# Altium schematic sheet Block Diagram.SchDoc
size A4
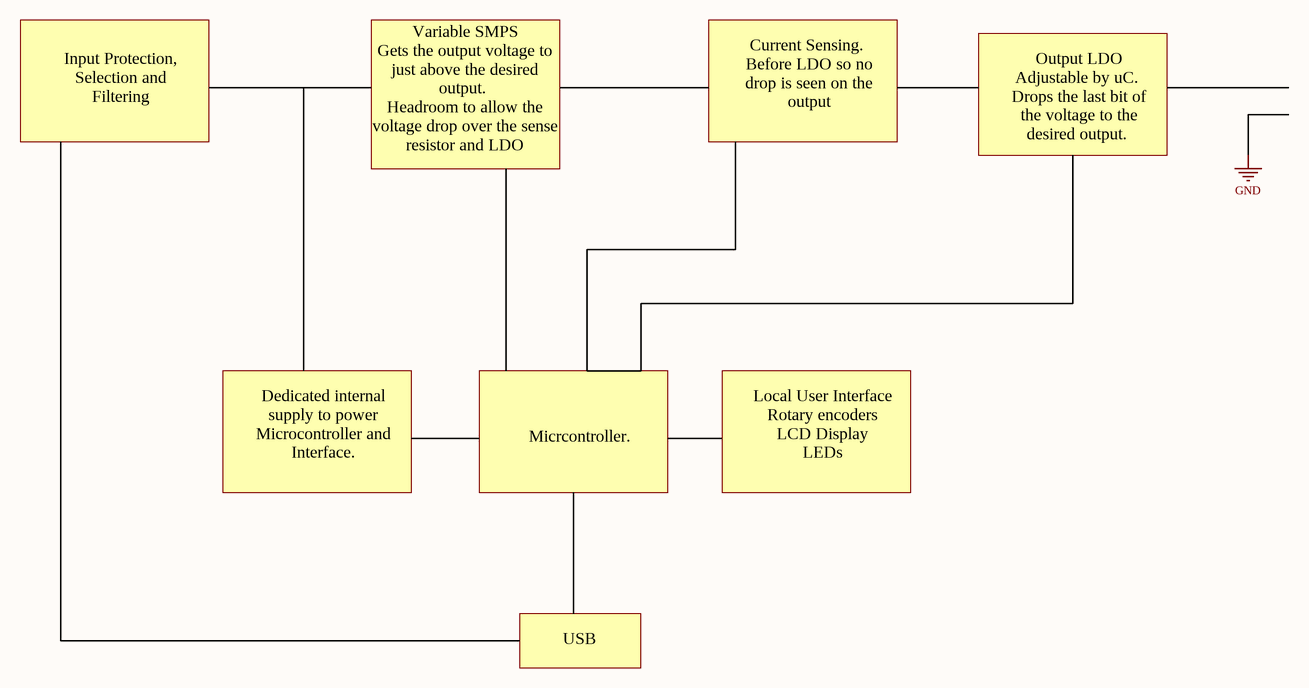
[diagram p0: Block Diagram.SchDoc]

## Notes on the sheet
- Input Protection, Selection and Filtering
- Current Sensing.
  Before LDO so no drop is seen on the output
- Variable SMPS
  Gets the output voltage to just above the desired output.
  Headroom to allow the voltage drop over the sense resistor and LDO
- Output LDO
  Adjustable by uC.
  Drops the last bit of the voltage to the desired output.
- Dedicated internal supply to power Microcontroller and Interface.
- Micrcontroller.
- Local User Interface
  Rotary encoders
  LCD Display
  LEDs
- USB
- Labels drawn without touching a wire or pin: GND